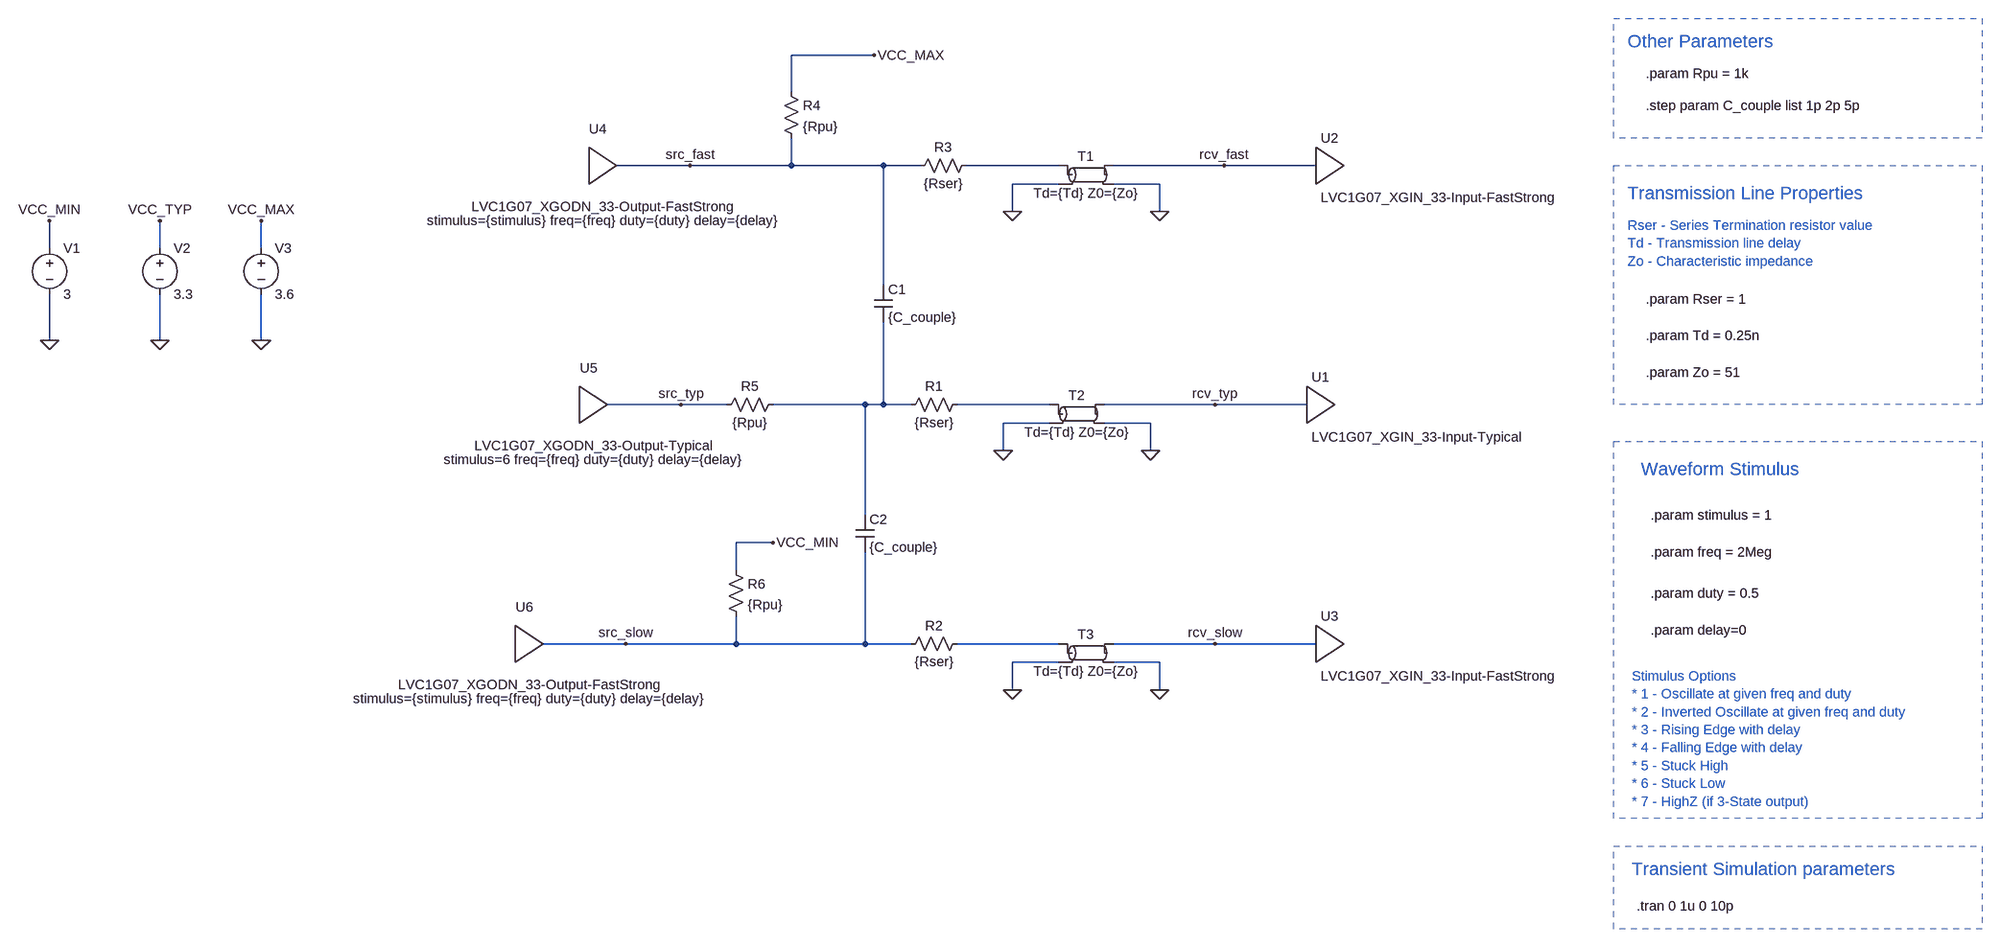
[diagram p0: schematic LVC1G07_Xtk.asc]
LVC1G07_Xtk.asc, the LTspice schematic file:
Version 4
SHEET 1 1856 1444
WIRE -640 -96 -784 -96
WIRE -784 -32 -784 -96
WIRE -960 96 -1088 96
WIRE -784 96 -784 48
WIRE -784 96 -960 96
WIRE -624 96 -784 96
WIRE -560 96 -624 96
WIRE -320 96 -480 96
WIRE -32 96 -224 96
WIRE 128 96 -32 96
WIRE -320 128 -400 128
WIRE -144 128 -224 128
WIRE -400 176 -400 128
WIRE -144 176 -144 128
WIRE -2160 240 -2160 192
WIRE -1968 240 -1968 192
WIRE -1792 240 -1792 192
WIRE -624 304 -624 96
WIRE -2160 400 -2160 320
WIRE -1968 400 -1968 320
WIRE -1792 400 -1792 320
WIRE -976 512 -1104 512
WIRE -896 512 -976 512
WIRE -656 512 -816 512
WIRE -624 512 -624 368
WIRE -624 512 -656 512
WIRE -576 512 -624 512
WIRE -336 512 -496 512
WIRE -48 512 -240 512
WIRE 112 512 -48 512
WIRE -336 544 -416 544
WIRE -160 544 -240 544
WIRE -416 592 -416 544
WIRE -160 592 -160 544
WIRE -656 704 -656 512
WIRE -816 752 -880 752
WIRE -880 800 -880 752
WIRE -1072 928 -1216 928
WIRE -880 928 -880 880
WIRE -880 928 -1072 928
WIRE -656 928 -656 768
WIRE -656 928 -880 928
WIRE -576 928 -656 928
WIRE -320 928 -496 928
WIRE -48 928 -224 928
WIRE 128 928 -48 928
WIRE -320 960 -400 960
WIRE -144 960 -224 960
WIRE -400 1008 -400 960
WIRE -144 1008 -144 960
FLAG -400 176 0
FLAG -144 176 0
FLAG -32 96 rcv_fast
FLAG -48 512 rcv_typ
FLAG -48 928 rcv_slow
FLAG -960 96 src_fast
FLAG -976 512 src_typ
FLAG -1072 928 src_slow
FLAG -416 592 0
FLAG -160 592 0
FLAG -400 1008 0
FLAG -144 1008 0
FLAG -2160 400 0
FLAG -2160 192 VCC_MIN
FLAG -1968 400 0
FLAG -1968 192 VCC_TYP
FLAG -1792 400 0
FLAG -1792 192 VCC_MAX
FLAG -816 752 VCC_MIN
FLAG -640 -96 VCC_MAX
SYMBOL tline -272 112 R0
SYMATTR InstName T1
SYMATTR Value Td={Td} Z0={Zo}
SYMBOL res -464 80 R90
WINDOW 0 0 56 VBottom 2
WINDOW 3 32 56 VTop 2
SYMATTR InstName R3
SYMATTR Value {Rser}
SYMBOL res -480 496 R90
WINDOW 0 0 56 VBottom 2
WINDOW 3 32 56 VTop 2
SYMATTR InstName R1
SYMATTR Value {Rser}
SYMBOL res -480 912 R90
WINDOW 0 0 56 VBottom 2
WINDOW 3 32 56 VTop 2
SYMATTR InstName R2
SYMATTR Value {Rser}
SYMBOL tline -288 528 R0
SYMATTR InstName T2
SYMATTR Value Td={Td} Z0={Zo}
SYMBOL tline -272 944 R0
SYMATTR InstName T3
SYMATTR Value Td={Td} Z0={Zo}
SYMBOL LVC1G07_XGIN_33-Input-FastStrong 128 32 R0
SYMATTR InstName U2
SYMBOL LVC1G07_XGIN_33-Input-Typical 112 448 R0
SYMATTR InstName U1
SYMBOL LVC1G07_XGODN_33-Output-FastStrong -1120 128 R0
SYMATTR InstName U4
SYMATTR SpiceLine stimulus={stimulus} freq={freq} duty={duty} delay={delay}
SYMBOL LVC1G07_XGODN_33-Output-Typical -1136 544 R0
SYMATTR InstName U5
SYMATTR SpiceLine stimulus=6 freq={freq} duty={duty} delay={delay}
SYMBOL res -800 -48 R0
SYMATTR InstName R4
SYMATTR Value {Rpu}
SYMBOL voltage -2160 224 R0
WINDOW 123 0 0 Left 0
WINDOW 39 0 0 Left 0
SYMATTR InstName V1
SYMATTR Value 3
SYMBOL voltage -1968 224 R0
WINDOW 123 0 0 Left 0
WINDOW 39 0 0 Left 0
SYMATTR InstName V2
SYMATTR Value 3.3
SYMBOL voltage -1792 224 R0
WINDOW 123 0 0 Left 0
WINDOW 39 0 0 Left 0
SYMATTR InstName V3
SYMATTR Value 3.6
SYMBOL res -800 496 R90
WINDOW 0 0 56 VBottom 2
WINDOW 3 32 56 VTop 2
SYMATTR InstName R5
SYMATTR Value {Rpu}
SYMBOL res -896 784 R0
SYMATTR InstName R6
SYMATTR Value {Rpu}
SYMBOL cap -640 304 R0
SYMATTR InstName C1
SYMATTR Value {C_couple}
SYMBOL cap -672 704 R0
SYMATTR InstName C2
SYMATTR Value {C_couple}
SYMBOL LVC1G07_XGIN_33-Input-FastStrong 128 864 R0
SYMATTR InstName U3
SYMBOL LVC1G07_XGODN_33-Output-FastStrong -1248 960 R0
SYMATTR InstName U6
SYMATTR SpiceLine stimulus={stimulus} freq={freq} duty={duty} delay={delay}
TEXT 760 1384 Left 2 !.tran 0 1u 0 10p
TEXT 776 328 Left 2 !.param Rser = 1
TEXT 776 392 Left 2 !.param Td = 0.25n
TEXT 776 456 Left 2 !.param Zo = 51
TEXT 784 704 Left 2 !.param stimulus = 1
TEXT 784 768 Left 2 !.param freq = 2Meg
TEXT 784 840 Left 2 !.param duty = 0.5
TEXT 784 904 Left 2 !.param delay=0
TEXT 744 144 Left 3 ;Transmission Line Properties
TEXT 744 200 Left 2 ;Rser - Series Termination resistor value\nTd - Transmission line delay\nZo - Characteristic impedance
TEXT 752 984 Left 2 ;Stimulus Options\n* 1 - Oscillate at given freq and duty\n* 2 - Inverted Oscillate at given freq and duty\n* 3 - Rising Edge with delay\n* 4 - Falling Edge with delay\n* 5 - Stuck High\n* 6 - Stuck Low\n* 7 - HighZ (if 3-State output)
TEXT 752 1320 Left 3 ;Transient Simulation parameters
TEXT 768 624 Left 3 ;Waveform Stimulus
TEXT 776 -64 Left 2 !.param Rpu = 1k
TEXT 744 -120 Left 3 ;Other Parameters
TEXT 776 -8 Left 2 !.step param C_couple list 1p 2p 5p
RECTANGLE Normal 1360 1424 720 1280 2
RECTANGLE Normal 1360 1232 720 576 2
RECTANGLE Normal 1360 512 720 96 2
RECTANGLE Normal 1360 48 720 -160 2

The netlist it stands for:
* LVC1G07_Xtk.asc
T1 N001 0 rcv_fast 0 Td={Td} Z0={Zo}
R3 N001 src_fast {Rser}
R1 N003 N002 {Rser}
R2 N004 src_slow {Rser}
T2 N003 0 rcv_typ 0 Td={Td} Z0={Zo}
T3 N004 0 rcv_slow 0 Td={Td} Z0={Zo}
XU2 rcv_fast LVC1G07_XGIN_33-Input-FastStrong  ; pins IN
XU1 rcv_typ LVC1G07_XGIN_33-Input-Typical  ; pins IN
XU4 src_fast LVC1G07_XGODN_33-Output-FastStrong stimulus={stimulus} freq={freq} duty={duty} delay={delay}  ; pins OUT
XU5 src_typ LVC1G07_XGODN_33-Output-Typical stimulus=6 freq={freq} duty={duty} delay={delay}  ; pins OUT
R4 VCC_MAX src_fast {Rpu}
V1 VCC_MIN 0 3
V2 VCC_TYP 0 3.3
V3 VCC_MAX 0 3.6
R5 N002 src_typ {Rpu}
R6 VCC_MIN src_slow {Rpu}
C1 src_fast N002 {C_couple}
C2 N002 src_slow {C_couple}
XU3 rcv_slow LVC1G07_XGIN_33-Input-FastStrong  ; pins IN
XU6 src_slow LVC1G07_XGODN_33-Output-FastStrong stimulus={stimulus} freq={freq} duty={duty} delay={delay}  ; pins OUT
.tran 0 1u 0 10p
.param Rser = 1
.param Td = 0.25n
.param Zo = 51
.param stimulus = 1
.param freq = 2Meg
.param duty = 0.5
.param delay=0
* Transmission Line Properties
* Rser - Series Termination resistor value
* Td - Transmission line delay
* Zo - Characteristic impedance
* Stimulus Options
* * 1 - Oscillate at given freq and duty
* * 2 - Inverted Oscillate at given freq and duty
* * 3 - Rising Edge with delay
* * 4 - Falling Edge with delay
* * 5 - Stuck High
* * 6 - Stuck Low
* * 7 - HighZ (if 3-State output)
* Transient Simulation parameters
* Waveform Stimulus
.param Rpu = 1k
* Other Parameters
.step param C_couple list 1p 2p 5p
.lib LVC1G07_XGIN_33-Input-FastStrong.sub
.lib LVC1G07_XGIN_33-Input-Typical.sub
.lib LVC1G07_XGODN_33-Output-FastStrong.sub
.lib LVC1G07_XGODN_33-Output-Typical.sub
.backanno
.end